# Altium schematic sheet Altium_Circuit_1_v03_RAM_ROM_4Plane.schdoc
size 309 x 223 mm; Symbol: Sheet-Symbol_A4; Device: Sheet-Symbol_A4; @Project Name: The20c_v03; @Page Count: 1; @Update Date: 2026-05-26; @Create Date: 2024-08-22; @Schematic Name: v03_RAM_ROM_4Plane; @Page No: 1; @Page Name: v03_RAM_ROM_4Plane; Company: OsoLabs.tech; Reviewed: OsoLabs; Version: v03_00; Page Size: A4; Part Number: v03_RAM_ROM_4Plane; Drawn: OsoLabs; @Board Name: v03_RAM_ROM_4Plane; @Create Time: 05:22:57; @Update Time: 10:40:45
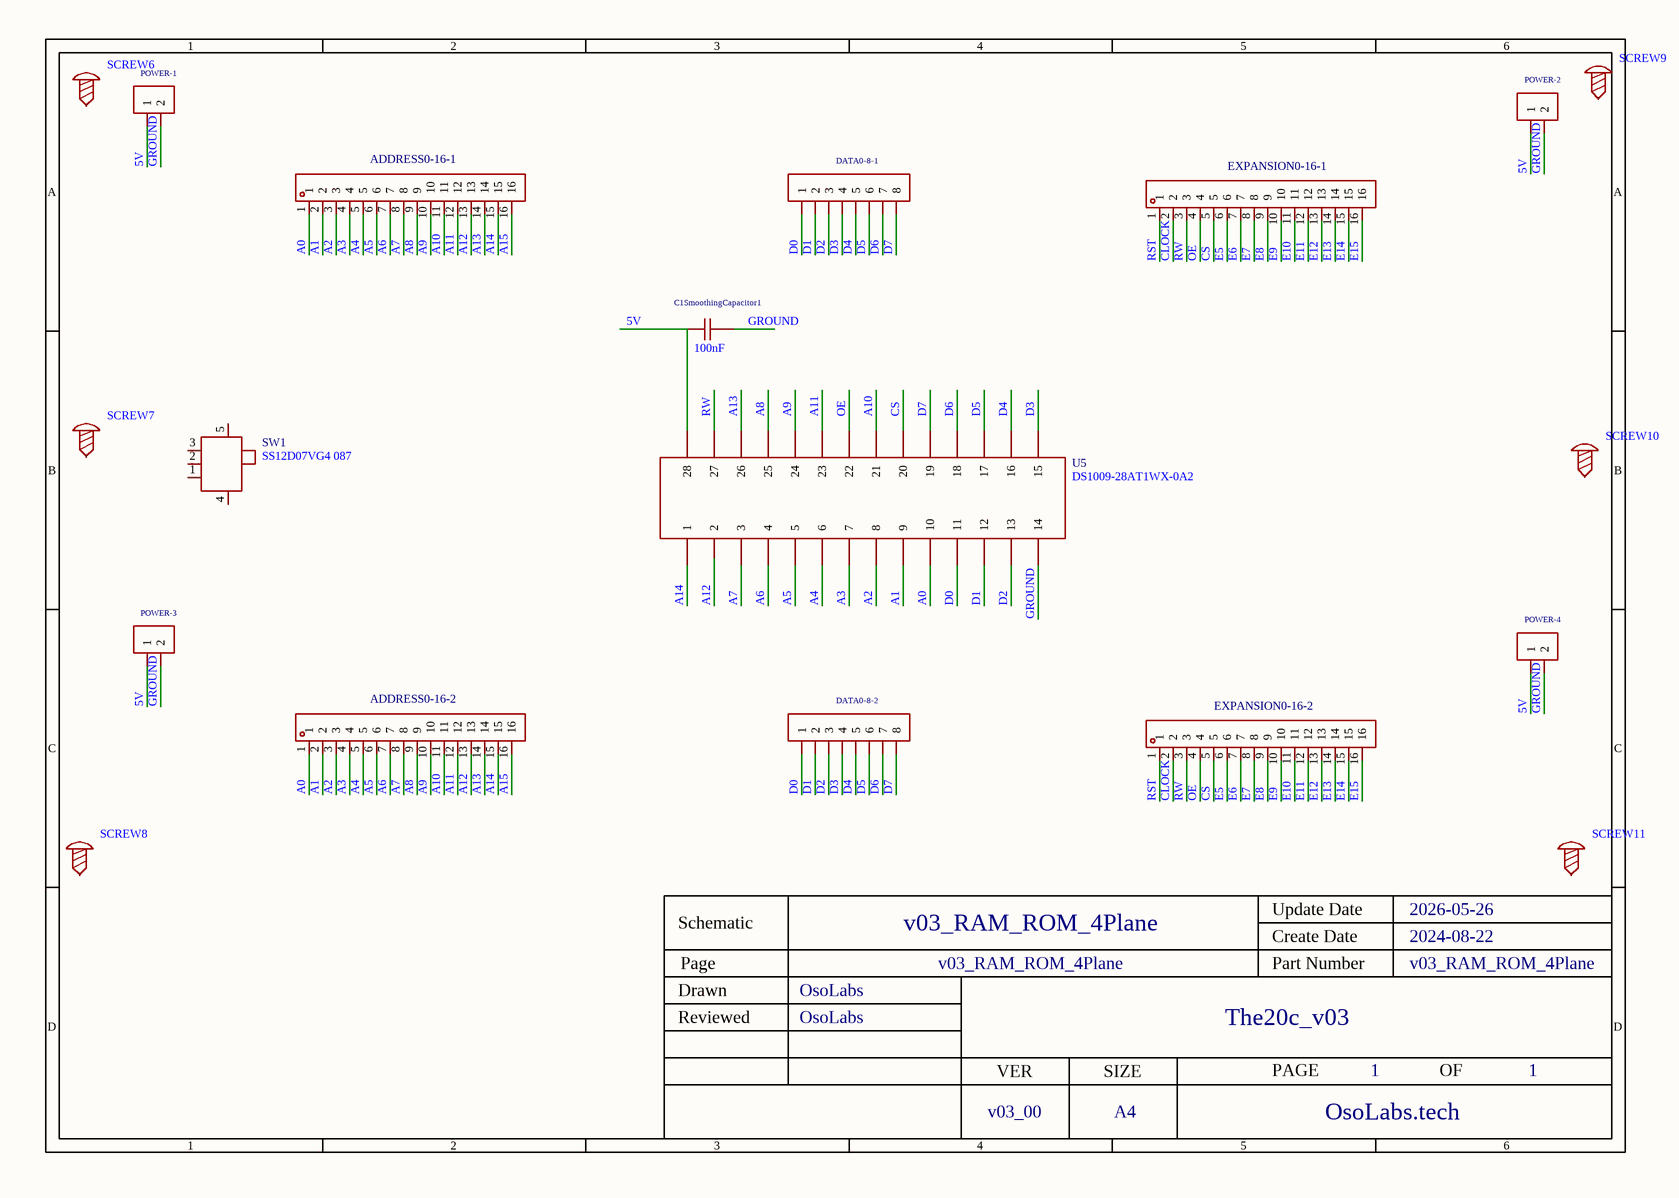
[diagram p0: Altium_Circuit_1_v03_RAM_ROM_4Plane.schdoc]

## Parts
ADDRESS0-16-1  PM254-1-16-Z-8.5  [HDR-TH_16P-P2.54-V-F-A]  (value not drawn)
ADDRESS0-16-2  PM254-1-16-Z-8.5  [HDR-TH_16P-P2.54-V-F-A]  (value not drawn)
C1SmoothingCapacitor1  100nF  [CAP-TH_L5.8-W2.4-P2.54-D0.6]
DATA0-8-1  2.54-1*8P母环保  [HDR-TH_8P-P2.54-V-F-1]  (value not drawn)
DATA0-8-2  2.54-1*8P母环保  [HDR-TH_8P-P2.54-V-F-1]  (value not drawn)
EXPANSION0-16-1  PM254-1-16-Z-8.5  [HDR-TH_16P-P2.54-V-F-A]  (value not drawn)
EXPANSION0-16-2  PM254-1-16-Z-8.5  [HDR-TH_16P-P2.54-V-F-A]  (value not drawn)
POWER-1  2.54-1*2P母  [HDR-TH_2P-P2.54-V-F]  (value not drawn)
POWER-2  2.54-1*2P母  [HDR-TH_2P-P2.54-V-F]  (value not drawn)
POWER-3  2.54-1*2P母  [HDR-TH_2P-P2.54-V-F]  (value not drawn)
POWER-4  2.54-1*2P母  [HDR-TH_2P-P2.54-V-F]  (value not drawn)
SCREW6  (no value)  [Screw-Hole-M3]
SCREW7  (no value)  [Screw-Hole-M3]
SCREW8  (no value)  [Screw-Hole-M3]
SCREW9  (no value)  [Screw-Hole-M3]
SCREW10  (no value)  [Screw-Hole-M3]
SCREW11  (no value)  [Screw-Hole-M3]
SW1  SS12D07VG4 087  [SW-TH_SS12D07VG4]
U5  DS1009-28AT1WX-0A2  [DIP-28_L35.6-W17.8-P2.54-LS15.2-BL]

## Nets
5V: C1SmoothingCapacitor1.1 POWER-1.1 POWER-2.1 POWER-3.1 POWER-4.1 U5.28
A0: ADDRESS0-16-1.1 ADDRESS0-16-2.1 U5.10
A1: ADDRESS0-16-1.2 ADDRESS0-16-2.2 U5.9
A2: ADDRESS0-16-1.3 ADDRESS0-16-2.3 U5.8
A3: ADDRESS0-16-1.4 ADDRESS0-16-2.4 U5.7
A4: ADDRESS0-16-1.5 ADDRESS0-16-2.5 U5.6
A5: ADDRESS0-16-1.6 ADDRESS0-16-2.6 U5.5
A6: ADDRESS0-16-1.7 ADDRESS0-16-2.7 U5.4
A7: ADDRESS0-16-1.8 ADDRESS0-16-2.8 U5.3
A8: ADDRESS0-16-1.9 ADDRESS0-16-2.9 U5.25
A9: ADDRESS0-16-1.10 ADDRESS0-16-2.10 U5.24
A10: ADDRESS0-16-1.11 ADDRESS0-16-2.11 U5.21
A11: ADDRESS0-16-1.12 ADDRESS0-16-2.12 U5.23
A12: ADDRESS0-16-1.13 ADDRESS0-16-2.13 U5.2
A13: ADDRESS0-16-1.14 ADDRESS0-16-2.14 U5.26
A14: ADDRESS0-16-1.15 ADDRESS0-16-2.15 U5.1
A15: ADDRESS0-16-1.16 ADDRESS0-16-2.16
CLOCK: EXPANSION0-16-1.2 EXPANSION0-16-2.2
CS: EXPANSION0-16-1.5 EXPANSION0-16-2.5 U5.20
D0: DATA0-8-1.1 DATA0-8-2.1 U5.11
D1: DATA0-8-1.2 DATA0-8-2.2 U5.12
D2: DATA0-8-1.3 DATA0-8-2.3 U5.13
D3: DATA0-8-1.4 DATA0-8-2.4 U5.15
D4: DATA0-8-1.5 DATA0-8-2.5 U5.16
D5: DATA0-8-1.6 DATA0-8-2.6 U5.17
D6: DATA0-8-1.7 DATA0-8-2.7 U5.18
D7: DATA0-8-1.8 DATA0-8-2.8 U5.19
E5: EXPANSION0-16-1.6 EXPANSION0-16-2.6
E6: EXPANSION0-16-1.7 EXPANSION0-16-2.7
E7: EXPANSION0-16-1.8 EXPANSION0-16-2.8
E8: EXPANSION0-16-1.9 EXPANSION0-16-2.9
E9: EXPANSION0-16-1.10 EXPANSION0-16-2.10
E10: EXPANSION0-16-1.11 EXPANSION0-16-2.11
E11: EXPANSION0-16-1.12 EXPANSION0-16-2.12
E12: EXPANSION0-16-1.13 EXPANSION0-16-2.13
E13: EXPANSION0-16-1.14 EXPANSION0-16-2.14
E14: EXPANSION0-16-1.15 EXPANSION0-16-2.15
E15: EXPANSION0-16-1.16 EXPANSION0-16-2.16
GROUND: C1SmoothingCapacitor1.2 POWER-1.2 POWER-2.2 POWER-3.2 POWER-4.2 U5.14
OE: EXPANSION0-16-1.4 EXPANSION0-16-2.4 U5.22
RST: EXPANSION0-16-1.1 EXPANSION0-16-2.1
RW: EXPANSION0-16-1.3 EXPANSION0-16-2.3 U5.27

Not connected (* = marked no-connect by the designer): SCREW6 1; SCREW7 1; SCREW8 1; SCREW9 1; SCREW10 1; SCREW11 1; SW1 1 2 3 4 5

## Notes on the sheet
- 1
- 2
- 3
- 4
- 5
- 6
- A
- B
- C
- Schematic
- v03_RAM_ROM_4Plane
- Create Date
- Update Date
- 2026-05-26
- 2024-08-22
- Reviewed
- Drawn
- Page
- OsoLabs
- Part Number
- The20c_v03
- D
- VER
- SIZE
- PAGE
- OF
- v03_00
- A4
- OsoLabs.tech

## Library data of the parts
ADDRESS0-16-1 ADDRESS0-16-2 EXPANSION0-16-1 EXPANSION0-16-2 = PM254-1-16-Z-8.5: Manufacturer: HCTL(华灿天禄); Add into BOM: yes; Holes Structure: 1x16P; Pitch: 2.54mm; Circular Hole / Square Hole: Square Holes; Number of Holes: 16P; Current Rating (Max): 3A; Holes Direction: Top; Soldering Temperature(Max): 260℃@5S; Symbol: PM254-1-16-Z-8.5; Device: PM254-1-16-Z-8.5; LCSC Part Name: 1x16P 间距:2.54mm 直插; Supplier Part: C2897379; Manufacturer Part: PM254-1-16-Z-8.5; Supplier Footprint: 插件,P=2.54mm; JLCPCB Part Class: Extended Part; Datasheet: https://atta.szlcsc.com/upload/public/pdf/source/20230609/534BE42964C679BDE98E061007C4ABD6.pdf; Supplier: LCSC; Convert to PCB: yes; Row Spacing: -; Mounting Type: Straight; Number of Rows: Plugin; Voltage Rating (Max): -; Insulation Height: 8.5mm; Contact Material: Copper Alloy; Operating Temperature Range: -40℃~+105℃
C1SmoothingCapacitor1 = CC1H104ZA1ED3F5P1100: Manufacturer: Dersonic(德尔创); Add into BOM: yes; Tolerance: -20%~+80%; Body Thickness: 2.4mm; Symbol: CC1H104ZA1ED3F5P1100; Device: CC1H104ZA1ED3F5P1100; Supplier: LCSC; Supplier Part: C2832506; Manufacturer Part: CC1H104ZA1ED3F5P1100; Value: 100nF; JLCPCB Part Class: Extended Part; LCSC Part Name: 100nF -20%~+80% 50V; Supplier Footprint: 插件,P=2.54mm; Datasheet: https://atta.szlcsc.com/upload/public/pdf/source/20211027/619020FDD8EBC9BBFCA73A5584FA164D.pdf; Convert to PCB: yes
DATA0-8-1 DATA0-8-2 = 2.54-1*8P母环保: Manufacturer: BOOMELE(博穆精密); Symbol: Header-Female-2.54_1x8; Add into BOM: yes; Holes Structure: 1x8P; Pitch: 2.54mm; Number of Holes: 8P; Device: 2.54-1*8P母环保; Supplier: LCSC; Manufacturer Part: 2.54-1*8P母环保; Supplier Part: C27438; JLCPCB Part Class: Extended Part; LCSC Part Name: 间距:2.54mm 1x8P 直插; Supplier Footprint: 插件,P=2.54mm; Datasheet: https://atta.szlcsc.com/upload/public/pdf/source/20231221/1CA800C6799ED97958773716FAA1BFFE.pdf; Convert to PCB: yes; Row Spacing: -; Mounting Type: Straight; Number of Rows: Plugin; Insulation Height: -; Contact Material: -; Contact Plating: -
POWER-1-POWER-4 = 2.54-1*2P母: Manufacturer: BOOMELE(博穆精密); Symbol: Header-Female-2.54_1x2; Add into BOM: yes; Holes Structure: 1x2P; Pitch: 2.54mm; Number of Holes: 2P; Device: 2.54-1*2P母; Supplier: LCSC; Manufacturer Part: 2.54-1*2P母; Supplier Part: C49661; JLCPCB Part Class: Extended Part; LCSC Part Name: 间距:2.54mm 1x2P 直插; Supplier Footprint: 插件,P=2.54mm; Datasheet: https://atta.szlcsc.com/upload/public/pdf/source/20210301/C2718488_F4427B881E42CAA8DDB0B1C12B3A522C.pdf; Convert to PCB: yes; Row Spacing: -; Mounting Type: Straight; Number of Rows: Plugin; Insulation Height: -; Contact Material: -; Contact Plating: -
SCREW6-SCREW11 = Screw-Hole-M3: Convert to PCB: yes; Symbol: Screw-Hole; Device: Screw-Hole-M3; Add into BOM: yes; Supplier Footprint: 插件
SW1 = SS12D07VG4 087: Manufacturer: SHOU HAN(首韩); Add into BOM: yes; Circuit: SPDT; Pin Style: PCPin; Switch Length: 8.7mm; Switch Width: 4.4mm; Switch Height: 4.7mm; Current Rating (DC): 500mA; Voltage Rating (DC): 50V; Mechanical Life: 5千次; Symbol: SS12D07VG4 087; Device: SS12D07VG4 087; LCSC Part Name: SS12D07VG4 087; Supplier Part: C2939726; Manufacturer Part: SS12D07VG4 087; Supplier Footprint: 插件; JLCPCB Part Class: Extended Part; Datasheet: https://atta.szlcsc.com/upload/public/pdf/source/20220106/E715996F66241B9FD900079FF66489BE.pdf; Supplier: LCSC; Convert to PCB: yes; Actuator Style: -; Mounting Style: Straight; Actuator Color: -; Current Rating (AC): -; Voltage Rating (AC): -; Operating Temperature: -10℃~+50℃
U5 = DS1009-28AT1WX-0A2: Manufacturer: CONNFLY; Add into BOM: yes; Adaptation Package Type: DIP; Pitch: 2.54mm; Row Spacing: 15.24mm; Number of Positions: 28P; Symbol: DS1009-28AT1WX-0A2; Device: DS1009-28AT1WX-0A2; LCSC Part Name: 间距2.54mm P数:28P; Supplier Part: C72121; Manufacturer Part: DS1009-28AT1WX-0A2; Supplier Footprint: DIP-28; JLCPCB Part Class: Extended Part; Datasheet: https://atta.szlcsc.com/upload/public/pdf/source/20160429/1461922462758.pdf; Supplier: LCSC; Convert to PCB: yes; Contact Plating: Tin